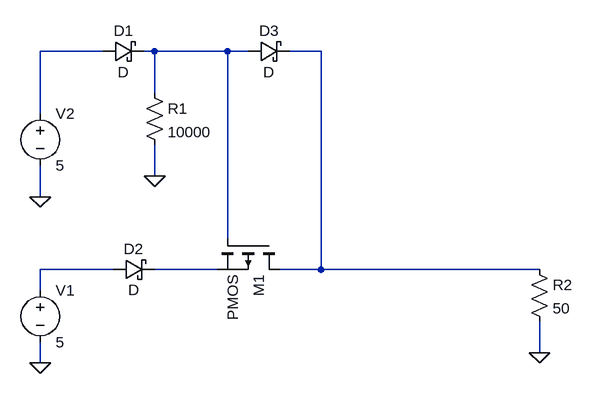
[diagram p0: schematic Power arbitration proposal.asc]
Power arbitration proposal.asc, the LTspice schematic file:
Version 4
SHEET 1 880 680
WIRE 112 144 16 144
WIRE 192 144 176 144
WIRE 304 144 192 144
WIRE 336 144 304 144
WIRE 448 144 400 144
WIRE 192 208 192 144
WIRE 16 240 16 144
WIRE 192 336 192 288
WIRE 16 368 16 320
WIRE 304 432 304 144
WIRE 128 480 16 480
WIRE 288 480 192 480
WIRE 448 480 448 144
WIRE 448 480 384 480
WIRE 784 480 448 480
WIRE 16 512 16 480
WIRE 784 608 784 560
WIRE 16 624 16 592
FLAG 784 608 0
FLAG 192 336 0
FLAG 16 368 0
FLAG 16 624 0
SYMBOL schottky 112 160 R270
WINDOW 0 32 32 VTop 2
WINDOW 3 0 32 VBottom 2
SYMATTR InstName D1
SYMBOL schottky 128 496 R270
WINDOW 0 32 32 VTop 2
WINDOW 3 0 32 VBottom 2
SYMATTR InstName D2
SYMBOL schottky 336 160 R270
WINDOW 0 32 32 VTop 2
WINDOW 3 0 32 VBottom 2
SYMATTR InstName D3
SYMBOL pmos 384 432 R90
SYMATTR InstName M1
SYMBOL res 176 192 R0
SYMATTR InstName R1
SYMATTR Value 10000
SYMBOL res 768 464 R0
SYMATTR InstName R2
SYMATTR Value 50
SYMBOL voltage 16 496 R0
SYMATTR InstName V1
SYMATTR Value 5
SYMBOL voltage 16 224 R0
SYMATTR InstName V2
SYMATTR Value 5

The netlist it stands for:
* Power arbitration proposal.asc
D1 N001 N002 D
D2 N004 N005 D
D3 N002 N003 D
M1 N003 N002 N005 N005 PMOS
R1 N002 0 10000
R2 N003 0 50
V1 N004 0 5
V2 N001 0 5
.model D D
.lib standard.dio
.model NMOS NMOS
.model PMOS PMOS
.lib standard.mos
.backanno
.end